# EAGLE design motor_controller_link (EAGLE 8.3.1)
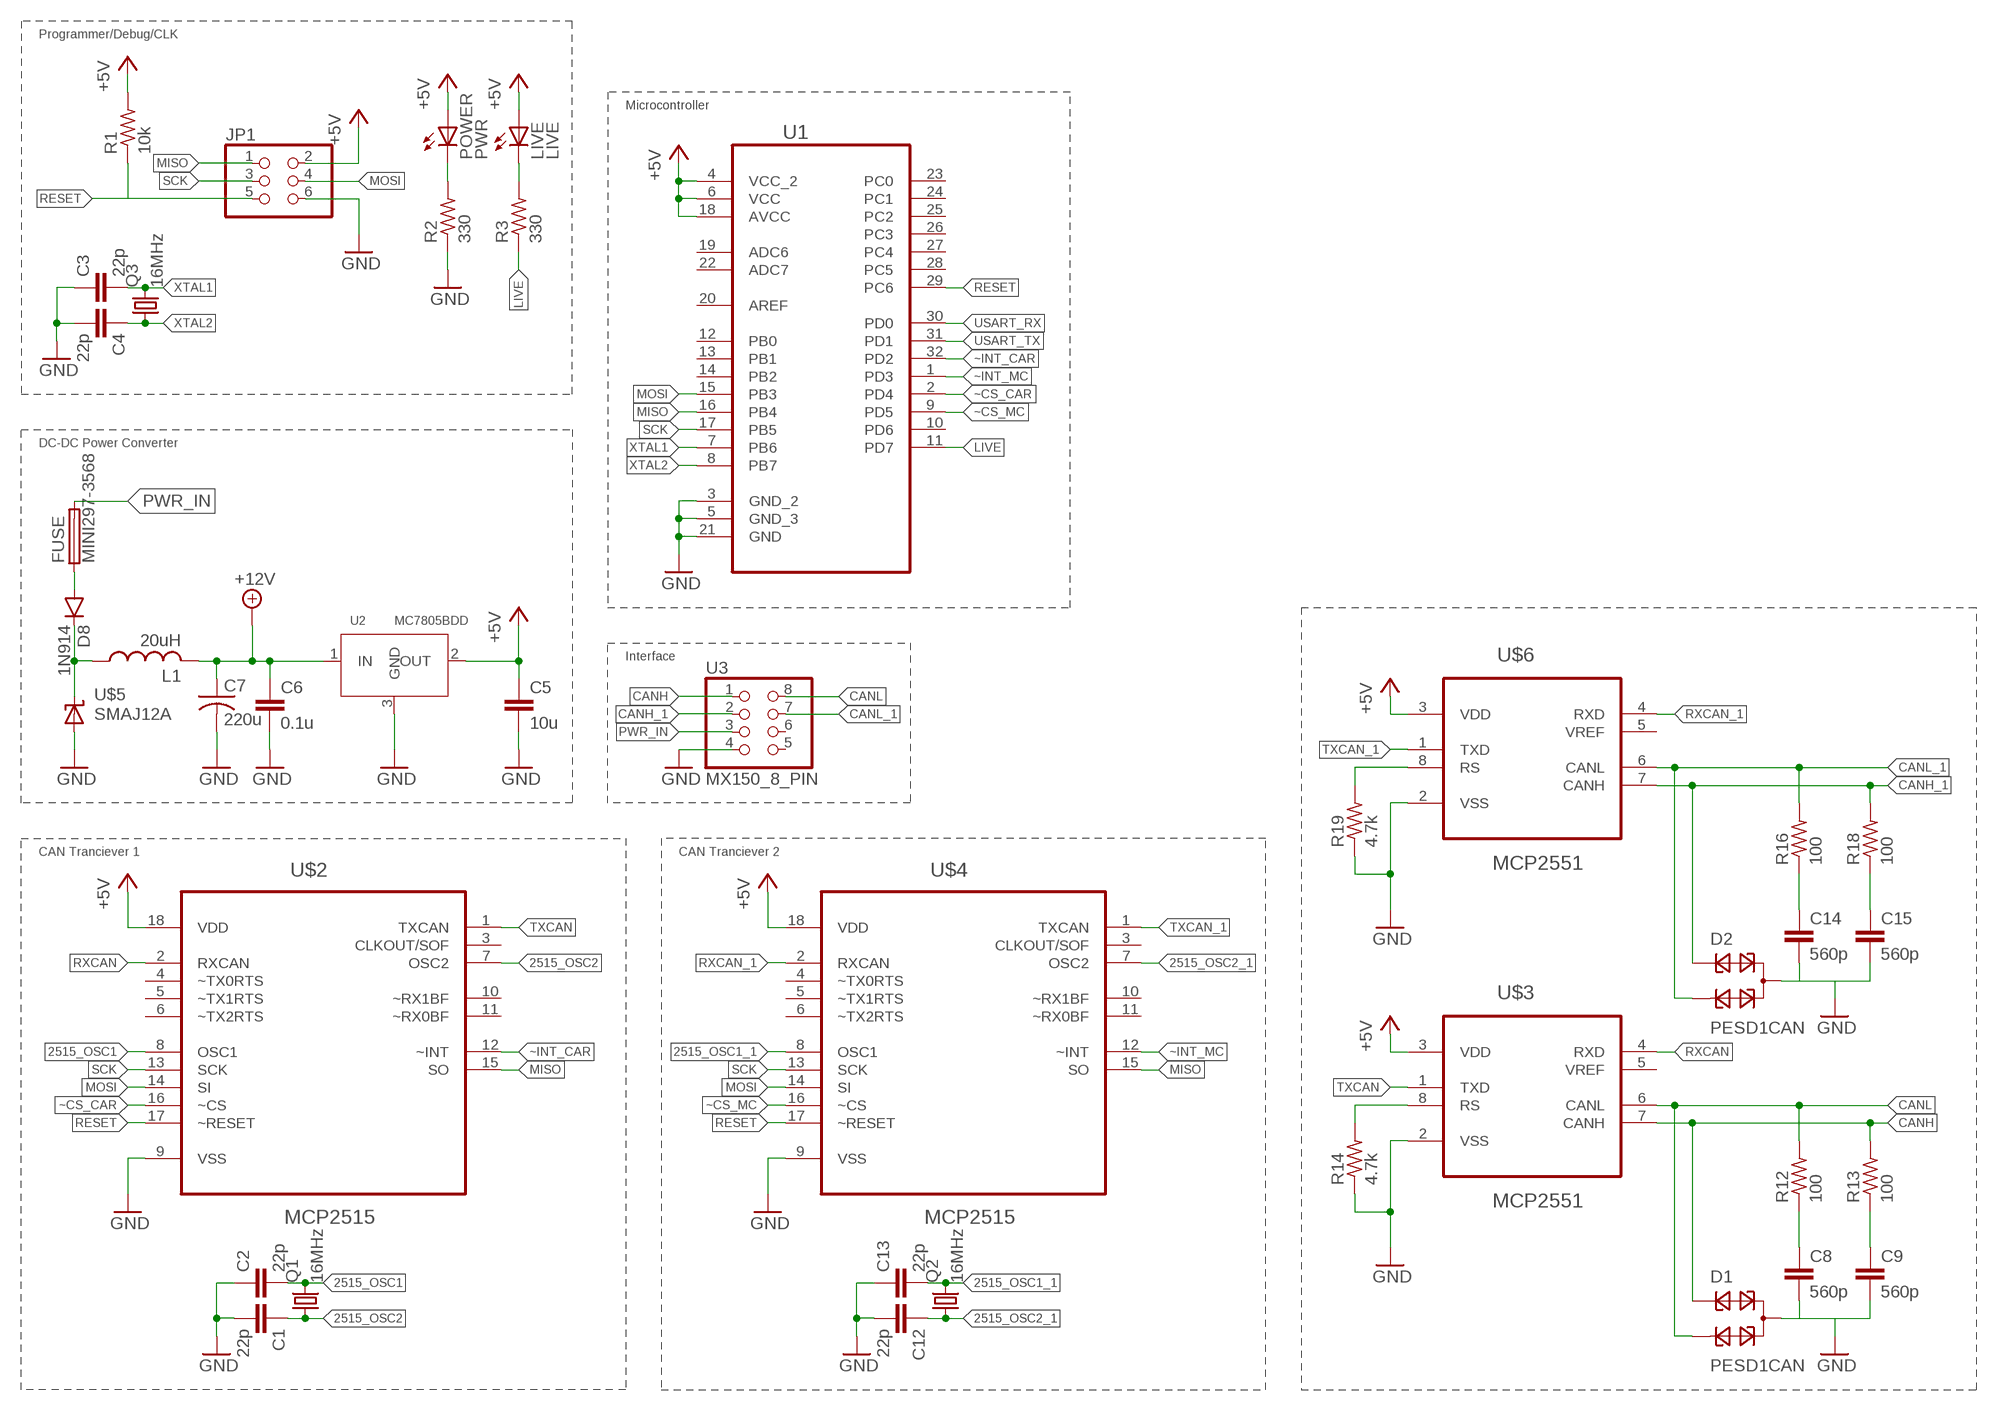
[diagram p0: schematic, sheet 1]

## Parts
C1  22p  C-EUC0805K  [C0805K]
C2  22p  C-EUC0805K  [C0805K]
C3  22p  C-EUC0805K  [C0805K]
C4  22p  C-EUC0805K  [C0805K]
C5  10u  C-EUC0805K  [C0805K]
C6  0.1u  C-EUC0805K  [C0805K]
C7  220u  C1206  [C1206]
C8  560p  C-EUC0805K  [C0805K]
C9  560p  C-EUC0805K  [C0805K]
C12  22p  C-EUC0805K  [C0805K]
C13  22p  C-EUC0805K  [C0805K]
C14  560p  C-EUC0805K  [C0805K]
C15  560p  C-EUC0805K  [C0805K]
D1  PESD1CAN  [SOT23]
D2  PESD1CAN  [SOT23]
D8  1N914  DIODESMA  [SMA-DIODE]
FUSE  MINI297-3568  [3568]
JP1  PINHD-2X3  [2X03]
L1  20uH  MSS7348  [MSS7348]
LIVE  LIVE  LEDSML0805  [SML0805]
POWER  PWR  LEDSML0805  [SML0805]
Q1  16MHz  CRYSTALCTS406  [CTS406]
Q2  16MHz  CRYSTALCTS406  [CTS406]
Q3  16MHz  CRYSTALCTS406  [CTS406]
R1  10k  R-US_R0805  [R0805]
R2  330  R-US_R0805  [R0805]
R3  330  R-US_R0805  [R0805]
R12  100  R-US_R0805  [R0805]
R13  100  R-US_R0805  [R0805]
R14  4.7k  R-US_R0805  [R0805]
R16  100  R-US_R0805  [R0805]
R18  100  R-US_R0805  [R0805]
R19  4.7k  R-US_R0805  [R0805]
U1  ATMEGA328P-AU  [QFP80P900X900X120-32N]
U2  MC7805BDD  [DPAK]
U3  MX150_8_PIN  [MX150_8]
U$2  MCP2515  MCP2515-I/SO  [SOIC127P1034X264-18N]
U$3  MCP2551  MCP2551-I/SN  [SOIC127P600X175-8N]
U$4  MCP2515  MCP2515-I/SO  [SOIC127P1034X264-18N]
U$5  SMAJ12A  [DO-214AC]
U$6  MCP2551  MCP2551-I/SN  [SOIC127P600X175-8N]

## Nets
2515_OSC1: C2.2 Q1.3 U$2.8(OSC1)
2515_OSC1_1: C13.2 Q2.3 U$4.8(OSC1)
2515_OSC2: C1.1 Q1.1 U$2.7(OSC2)
2515_OSC2_1: C12.1 Q2.1 U$4.7(OSC2)
+5V: C5.1 JP1.2 LIVE.A POWER.A R1.2 U1.4(VCC_2) U1.6(VCC) U1.18(AVCC) U2.2(OUT) U$2.18(VDD) U$3.3(VDD) U$4.18(VDD) U$6.3(VDD)
+12V: C6.1 C7.1 L1.P$2 U2.1(IN)
CANH: D1.1 R13.2 U3.1 U$3.7(CANH)
CANH_1: D2.1 R18.2 U3.2 U$6.7(CANH)
CANL: D1.2 R12.2 U3.8 U$3.6(CANL)
CANL_1: D2.2 R16.2 U3.7 U$6.6(CANL)
GND: C1.2 C2.1 C3.1 C4.2 C5.2 C6.2 C7.2 C8.2 C9.2 C12.2 C13.1 C14.2 C15.2 D1.3 D2.3 JP1.6 R2.1 R14.1 R19.1 U1.3(GND_2) U1.5(GND_3) U1.21(GND) U2.3(GND) U3.4 U$2.9(VSS) U$3.2(VSS) U$4.9(VSS) U$5.A U$6.2(VSS)
LIVE: R3.1 U1.11(PD7)
MISO: JP1.1 U1.16(PB4) U$2.15(SO) U$4.15(SO)
MOSI: JP1.4 U1.15(PB3) U$2.14(SI) U$4.14(SI)
N$1: R14.2 U$3.8(RS)
N$2: C14.1 R16.1
N$4: POWER.C R2.2
N$5: LIVE.C R3.2
N$6: C8.1 R12.1
N$7: C9.1 R13.1
N$9: C15.1 R18.1
N$10: D8.C L1.P$1 U$5.C
N$11: R19.2 U$6.8(RS)
N$12: D8.A FUSE.P$1 FUSE.P$4
PWR_IN: FUSE.P$2 FUSE.P$3 U3.3
RESET: JP1.5 R1.1 U1.29(PC6) U$2.17(~RESET) U$4.17(~RESET)
RXCAN: U$2.2(RXCAN) U$3.4(RXD)
RXCAN_1: U$4.2(RXCAN) U$6.4(RXD)
SCK: JP1.3 U1.17(PB5) U$2.13(SCK) U$4.13(SCK)
TXCAN: U$2.1(TXCAN) U$3.1(TXD)
TXCAN_1: U$4.1(TXCAN) U$6.1(TXD)
USART_RX: U1.30(PD0)
USART_TX: U1.31(PD1)
XTAL1: C3.2 Q3.3 U1.7(PB6)
XTAL2: C4.1 Q3.1 U1.8(PB7)
~CS_CAR: U1.2(PD4) U$2.16(~CS)
~CS_MC: U1.9(PD5) U$4.16(~CS)
~INT_CAR: U1.32(PD2) U$2.12(~INT)
~INT_MC: U1.1(PD3) U$4.12(~INT)
Unconnected: U1.10(PD6) U1.12(PB0) U1.13(PB1) U1.14(PB2) U1.19(ADC6) U1.20(AREF) U1.22(ADC7) U1.23(PC0) U1.24(PC1) U1.25(PC2) U1.26(PC3) U1.27(PC4) U1.28(PC5) U3.5 U3.6 U$2.3(CLKOUT/SOF) U$2.4(~TX0RTS) U$2.5(~TX1RTS) U$2.6(~TX2RTS) U$2.10(~RX1BF) U$2.11(~RX0BF) U$3.5(VREF) U$4.3(CLKOUT/SOF) U$4.4(~TX0RTS) U$4.5(~TX1RTS) U$4.6(~TX2RTS) U$4.10(~RX1BF) U$4.11(~RX0BF) U$6.5(VREF)

## Notes on the sheet
- Programmer/Debug/CLK
- Microcontroller
- DC-DC Power Converter
- Interface
- CAN Tranciever 1 | CAN Tranciever 2

## Library data of the parts
C1-C4 C12 C13 = resistor:C-EU: CAPACITOR, European symbol
C5 C6 C8 C9 C14 C15 = rcl:C-EU: CAPACITOR, European symbol
C7 = Capacitors:C1206
D1 D2 = diode:PESD1CAN: CAN bus ESD protection diode Source: http://www.nxp.com/documents/data_sheet/PESD1CAN.pdf
D8 = SparkFun-DiscreteSemi:DIODE: Diode These are standard reverse protection diodes and small signal diodes. SMA package can handle up to about 1A. SOD-323 can handle about 200mA. What the SOD-323 package when ordering, there are some mfgs out there that are 5-pin packages.
FUSE = Fuse:MINI297-3568
JP1 = pinhead:PINHD-2X3: PIN HEADER
L1 = Inductors:MSS7348
LIVE POWER = led:LED: LED OSRAM: - CHIPLED LG R971, LG N971, LY N971, LG Q971, LY Q971, LO R971, LY R971 LH N974, LH R974 LS Q976, LO Q976, LY Q976 LO Q996 - Hyper CHIPLED LW Q18S LB Q993, LB Q99A, LB R99A - SideLED LS A670, LO A670, LY A670, LG A670, LP A670 LB A673, LV A673, LT A673, LW A673 LH A674 LY A675 LS A676, LA A676, LO A676, LY A676, LW A676 LS A679, LY A679, LG A679 - Hyper Micro SIDELED® LS Y876, LA Y876, LO Y876, LY Y876 LT Y87S - SmartLED LW L88C, LW L88S LB L89C, LB L89S, LG L890 LS L89K, LO L89K, LY L89K LS L896, LA L896, LO L896, LY L896 - TOPLED LS T670, LO T670, LY T670, LG T670, LP T670 LSG T670, LSP T670, LSY T670, LOP T670, LYG T670 LG T671, LOG T671, LSG T671 LB T673, LV T673, LT T673, LW T673 LH T674 LS T676, LA T676, LO T676, LY T676, LB T676, LH T676, LSB T676, LW T676 LB T67C, LV T67C, LT T67C, LS T67K, LO T67K, LY T67K, LW E67C LS E67B, LA E67B, LO E67B, LY E67B, LB E67C, LV E67C, LT E67C LW T67C LS T679, LY T679, LG T679 LS T770, LO T770, LY T770, LG T770, LP T770 LB T773, LV T773, LT T773, LW T773 LH T774 LS E675, LA E675, LY E675, LS T675 LS T776, LA T776, LO T776, LY T776, LB T776 LHGB T686 LT T68C, LB T68C - Hyper Mini TOPLED® LB M676 - Mini TOPLED Santana® LG M470 LS M47K, LO M47K, LY M47K Source: http://www.osram.convergy.de LUXEON: - LUMILED® LXK2-PW12-R00, LXK2-PW12-S00, LXK2-PW14-U00, LXK2-PW14-V00 LXK2-PM12-R00, LXK2-PM12-S00, LXK2-PM14-U00 LXK2-PE12-Q00, LXK2-PE12-R00, LXK2-PE12-S00, LXK2-PE14-T00, LXK2-PE14-U00 LXK2-PB12-K00, LXK2-PB12-L00, LXK2-PB12-M00, LXK2-PB14-N00, LXK2-PB14-P00, LXK2-PB14-Q00 LXK2-PR12-L00, LXK2-PR12-M00, LXK2-PR14-Q00, LXK2-PR14-R00 LXK2-PD12-Q00, LXK2-PD12-R00, LXK2-PD12-S00 LXK2-PH12-R00, LXK2-PH12-S00 LXK2-PL12-P00, LXK2-PL12-Q00, LXK2-PL12-R00 Source: www.luxeon.com KINGBRIGHT: KA-3528ASYC Source: www.kingbright.com
Q1-Q3 = adafruit:CRYSTAL: CRYSTAL; OC_FARNELL: unknown; OC_NEWARK: unknown
R1-R3 R12-R14 R16 R18 R19 = rcl:R-US_: RESISTOR, American symbol
U1 = Atmel_By_element14_Batch_1-00:ATMEGA328P-AU: 8-bit Microcontroller with In-System Programmable Flash; MPN: ATMEGA328P-AU; OC_FARNELL: 1715486; OC_NEWARK: 14R4631; PACKAGE: TQFP-32; SUPPLIER: Atmel
U2 = IC's:MC7805BD
U3 = Connectors:MX150_8_PIN
U$2 U$4 = Microchip_By_element14_Batch_1:MCP2515-I/SO: CAN Controller; MPN: MCP2515-I/SO; OC_FARNELL: 1292239; OC_NEWARK: 29H7136; PACKAGE: SOIC-18; SUPPLIER: Microchip
U$3 U$6 = Microchip_By_element14_Batch_1:MCP2551-I/SN: High-Speed CAN Transceiver; MPN: MCP2551-I/SN; OC_FARNELL: 9758569; OC_NEWARK: 69K7604; PACKAGE: SOIC-8; SUPPLIER: Microchip
U$5 = Can_Network_Endpnt.lbr:SMAJ12A

## Board
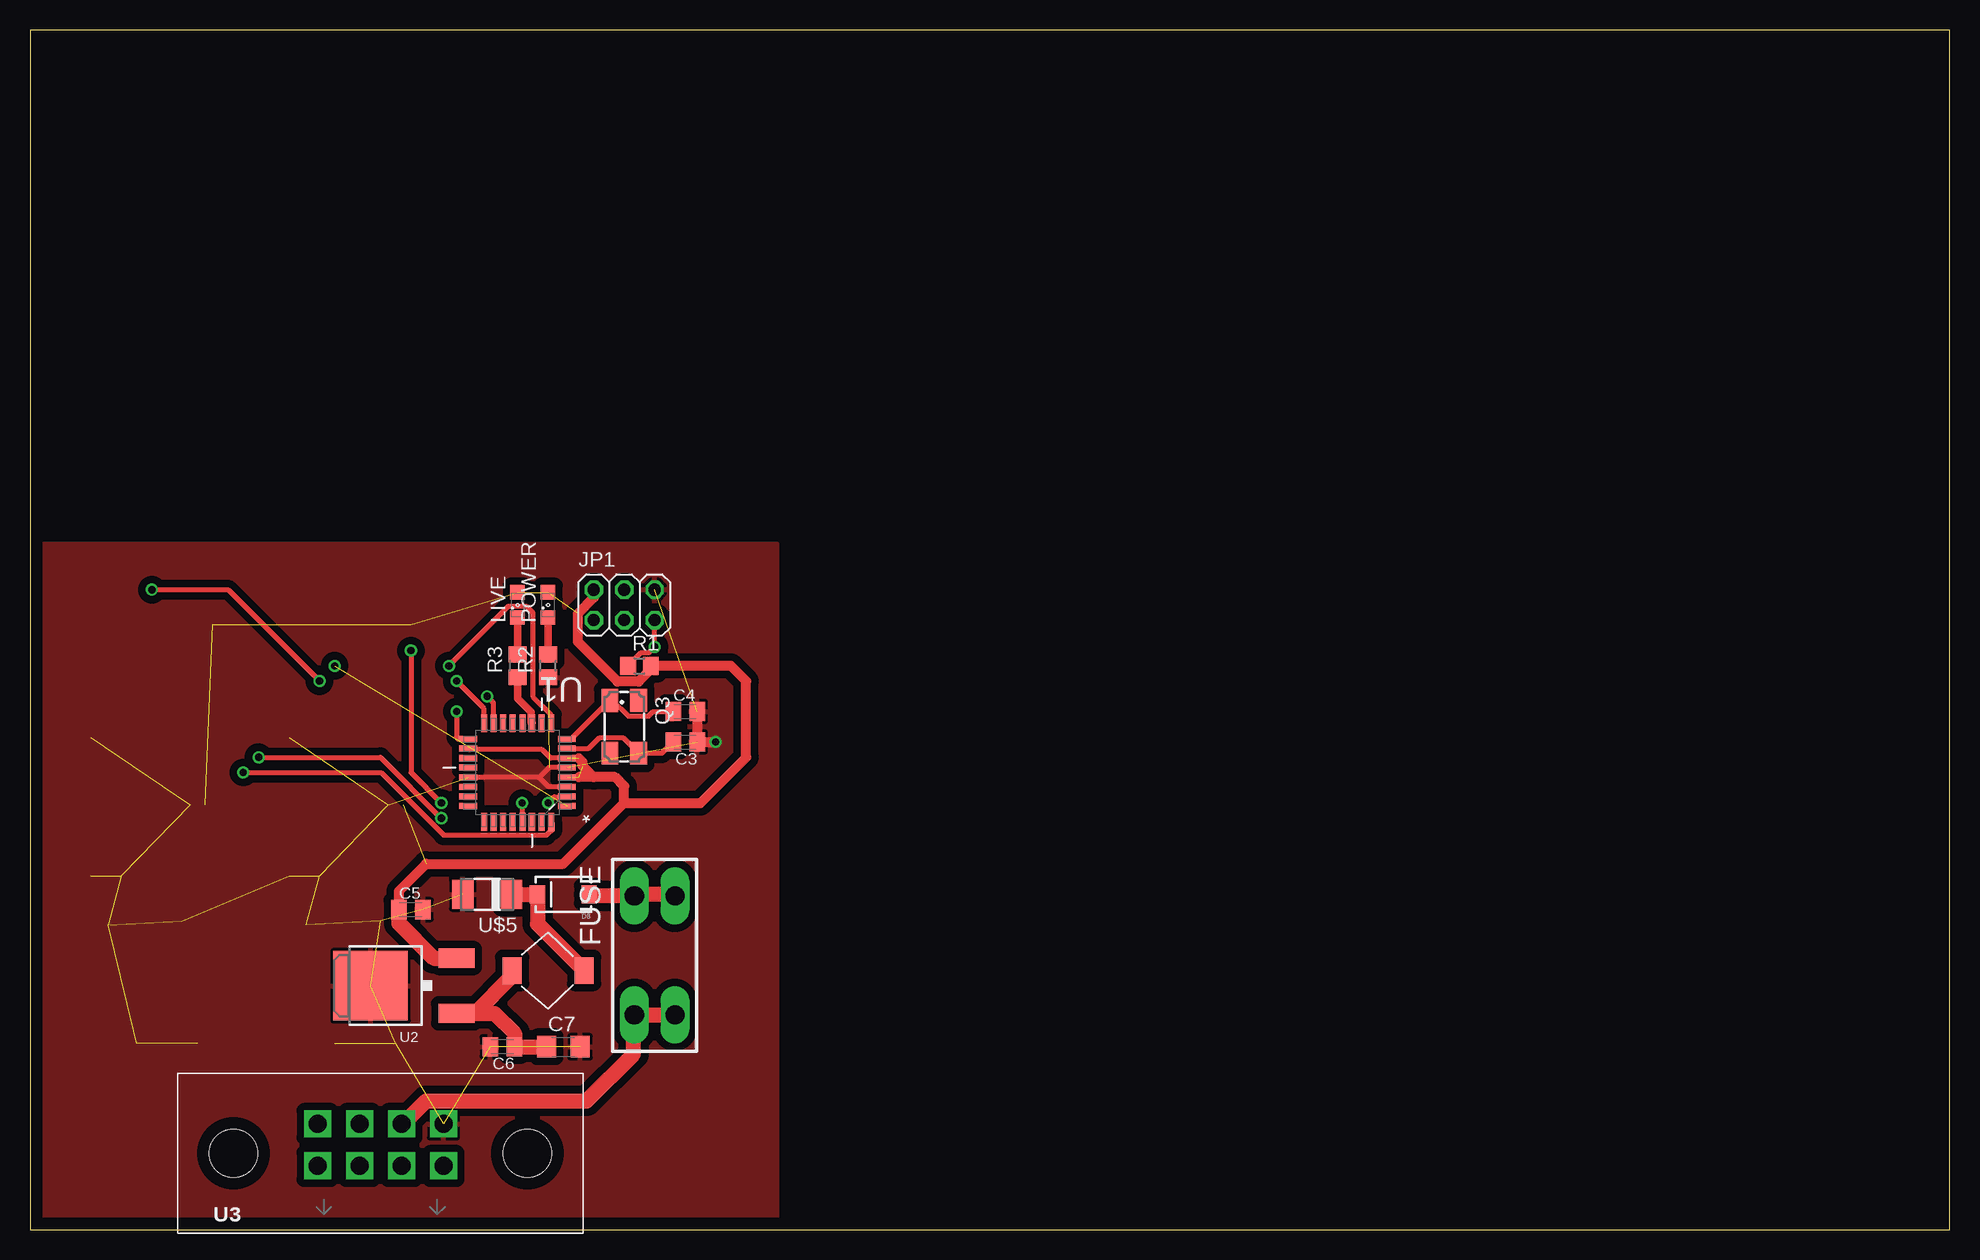
[diagram p1: board, top side]
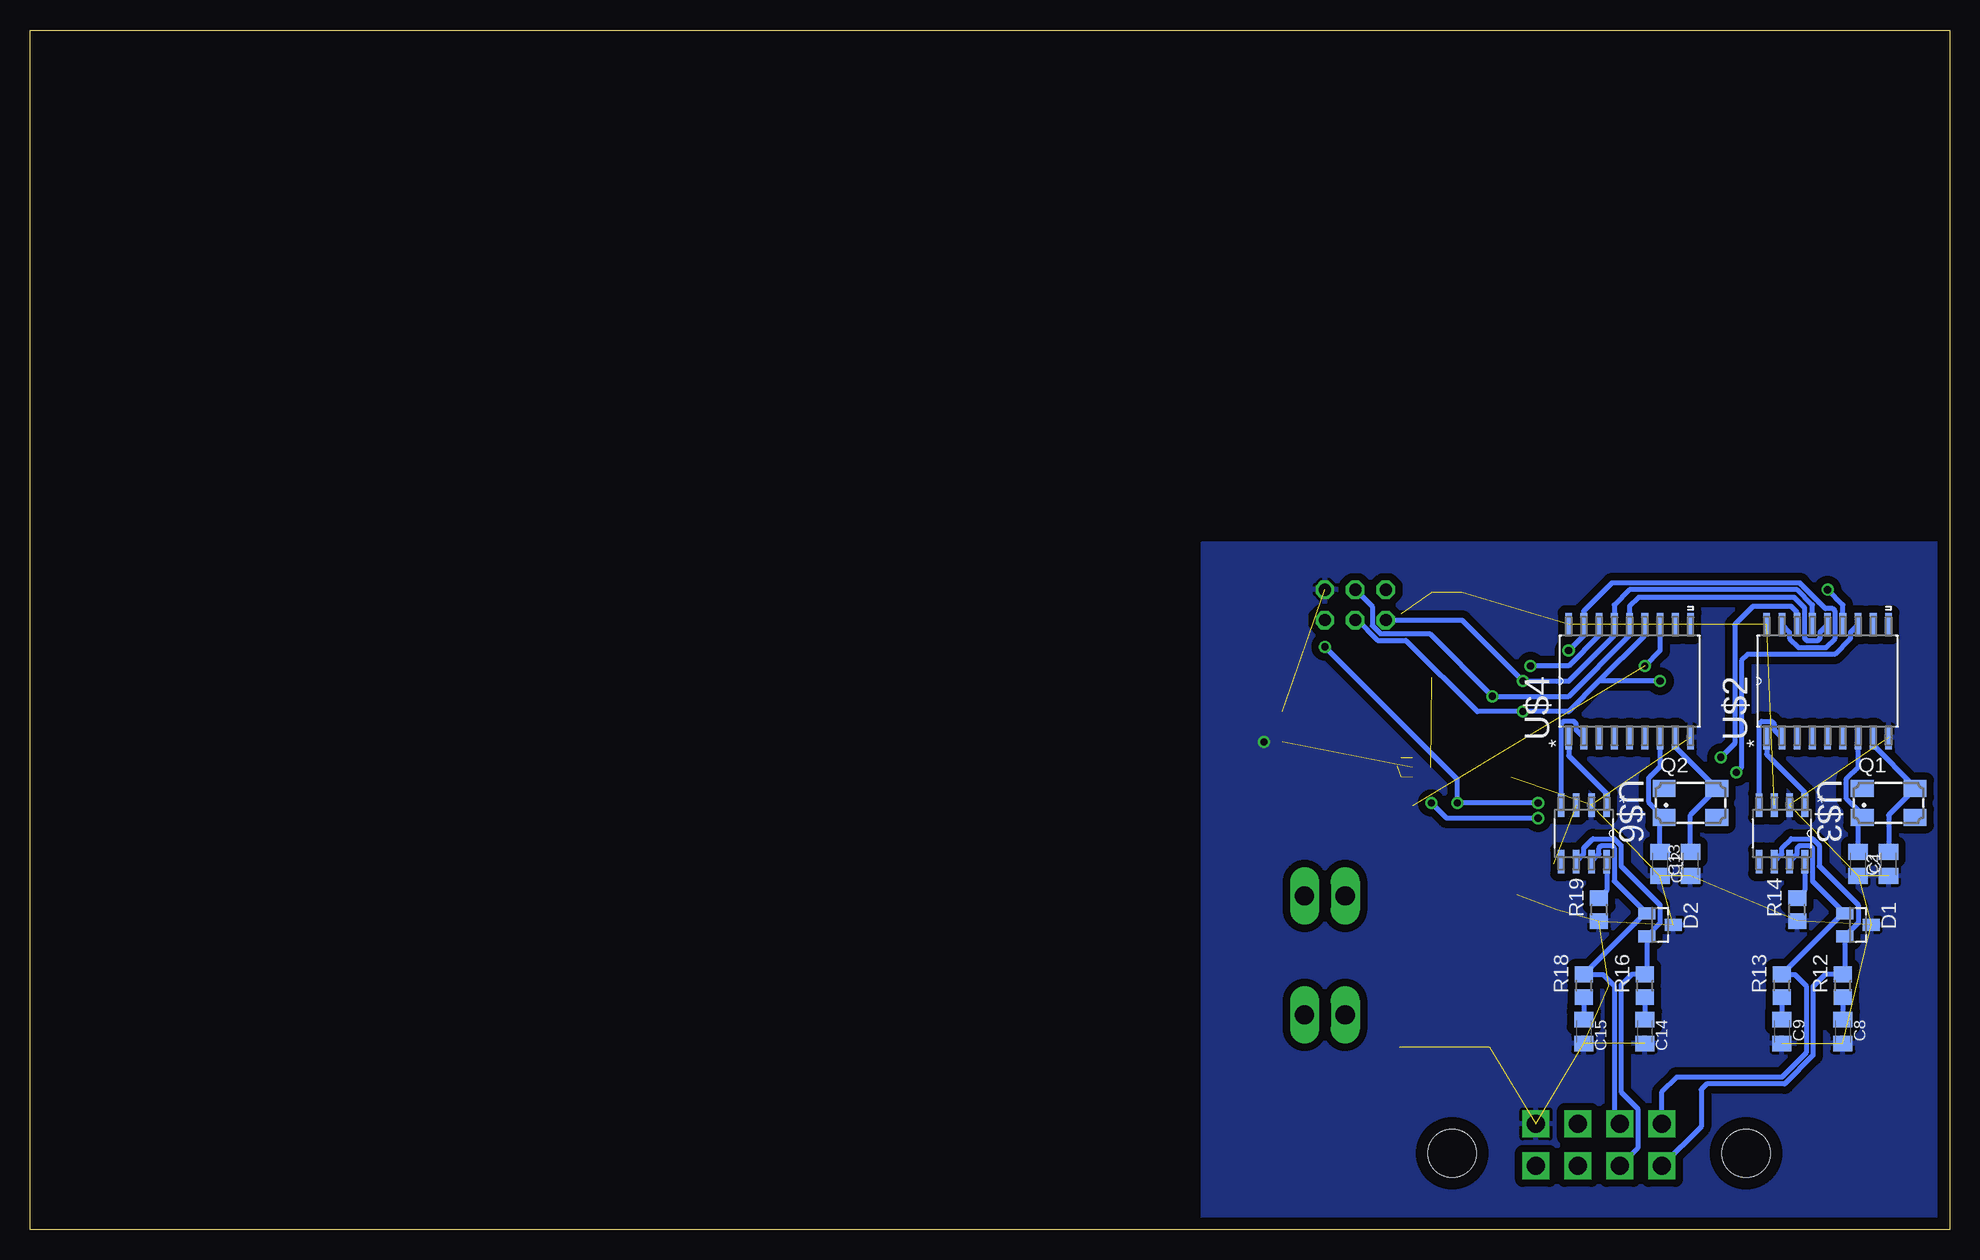
[diagram p2: board, bottom side, seen from below]

Size 160 x 100 mm. Coordinates in mm from the lower left corner, seen from the top.
Outline: 0,0 160,0 160,100 0,100 0,0
Copper layers (1*16): Top 0.035mm / dielectric 1.5mm / Bottom 0.035mm
Design rules "default": minimum track width 6mil, minimum drill 0.35mm, track to track 6mil, track to pad 6mil, pad to pad 6mil, via to via 6mil, smd to smd 6mil, copper to edge 40mil, drill to drill 6mil, minimum pad ring 10mil, minimum via ring 8mil, stop-mask expansion 4mil, vias tented up to drill 0mil, thermal gap 10mil

### Footprints (pad centres in the part's own frame; a part is rotated, then mirrored left to right if it is on the bottom)
C0805K = smd 1.3 x 1.6: 1 -1,0; 2 1,0
C1206 = smd 1.6 x 1.8: 1 -1.4,0; 2 1.4,0
SOT23 = smd 1 x 1.4: 1 -0.95,-1.1; 2 0.95,-1.1; 3 0,1.1
SMA-DIODE = smd 1.27 x 1.47: A -2.15,0; C 2.15,0
3568 = drill 1.6 long: P$1 -4.96,1.7; P$2 4.96,1.7; P$3 4.96,-1.7; P$4 -4.96,-1.7
2X03 = drill 1.016 octagon: 1 -2.54,-1.27; 2 -2.54,1.27; 3 0,-1.27; 4 0,1.27; 5 2.54,-1.27; 6 2.54,1.27
MSS7348 = smd 1.6 x 2.2: P$1 -3,0; P$2 3,0
SML0805 = smd 1.2 x 1.2: A 1.05,0; C -1.05,0
CTS406 = smd 1.9 x 1.4: 1 -2.2,-1.2; 2 2.2,-1.2; 3 2.2,1.2; 4 -2.2,1.2
R0805 = smd 1.3 x 1.5: 1 -0.95,0; 2 0.95,0
QFP80P900X900X120-32N = smd 1.473 x 0.508: 1 -4.115,2.794; 2 -4.115,2.007; 3 -4.115,1.194; 4 -4.115,0.406; 5 -4.115,-0.406; 6 -4.115,-1.194; 7 -4.115,-2.007; 8 -4.115,-2.794; 17 4.115,-2.794; 18 4.115,-2.007; 19 4.115,-1.194; 20 4.115,-0.406; 21 4.115,0.406; 22 4.115,1.194; 23 4.115,2.007; 24 4.115,2.794 | smd 0.508 x 1.473: 9 -2.794,-4.115; 10 -2.007,-4.115; 11 -1.194,-4.115; 12 -0.406,-4.115; 13 0.406,-4.115; 14 1.194,-4.115; 15 2.007,-4.115; 16 2.794,-4.115; 25 2.794,4.115; 26 2.007,4.115; 27 1.194,4.115; 28 0.406,4.115; 29 -0.406,4.115; 30 -1.194,4.115; 31 -2.007,4.115; 32 -2.794,4.115
DPAK = smd 3 x 1.6: 1 0,-2.3; 2 0,2.3 | smd 6.2 x 5.8: 3 -7.18,0
MX150_8 = drill 1.5 square: 1 -5.25,2.46; 2 -1.75,2.46; 3 1.75,2.46; 4 5.25,2.46; 5 5.25,-1.04; 6 1.75,-1.04; 7 -1.75,-1.04; 8 -5.25,-1.04 | hole 4: -12.25,0; 12.25,0
SOIC127P1034X264-18N = smd 1.981 x 0.559: 1 -4.699,5.08; 2 -4.699,3.81; 3 -4.699,2.54; 4 -4.699,1.27; 5 -4.699,0; 6 -4.699,-1.27; 7 -4.699,-2.54; 8 -4.699,-3.81; 9 -4.699,-5.08; 10 4.699,-5.08; 11 4.699,-3.81; 12 4.699,-2.54; 13 4.699,-1.27; 14 4.699,0; 15 4.699,1.27; 16 4.699,2.54; 17 4.699,3.81; 18 4.699,5.08
SOIC127P600X175-8N = smd 1.981 x 0.559: 1 -2.362,1.905; 2 -2.362,0.635; 3 -2.362,-0.635; 4 -2.362,-1.905; 5 2.362,-1.905; 6 2.362,-0.635; 7 2.362,0.635; 8 2.362,1.905
DO-214AC = smd 1.8 x 2.4: A 2.025,0; C -2.025,0

### Placement (x,y rotation side)
C1  7.62,30.48 270 bottom
C2  5.08,30.48 90 bottom
C3  54.61,40.64 180 top
C4  54.61,43.18 0 top
C5  31.75,26.67 0 top
C6  39.37,15.24 180 top
C7  44.45,15.24 0 top
C8  8.89,16.51 270 bottom
C9  13.97,16.51 270 bottom
C12  24.13,30.48 270 bottom
C13  21.59,30.48 90 bottom
C14  25.4,16.51 270 bottom
C15  30.48,16.51 270 bottom
D1  7.62,25.4 270 bottom
D2  24.13,25.4 270 bottom
D8  44.45,27.94 180 top
FUSE  52.07,22.86 270 top
JP1  49.53,52.07 0 top
L1  43.18,21.59 180 top
LIVE  40.64,52.07 90 top
POWER  43.18,52.07 90 top
Q1  5.08,35.56 0 bottom
Q2  21.59,35.56 0 bottom
Q3  49.53,41.91 270 top
R1  50.8,46.99 0 top
R2  43.18,46.99 90 top
R3  40.64,46.99 90 top
R12  8.89,20.32 90 bottom
R13  13.97,20.32 90 bottom
R14  12.7,26.67 90 bottom
R16  25.4,20.32 90 bottom
R18  30.48,20.32 90 bottom
R19  29.21,26.67 90 bottom
U1  40.64,38.1 180 top
U2  35.56,20.32 0 top
U3  29.21,6.35 0 top
U$2  10.16,45.72 90 bottom
U$3  13.97,33.02 270 bottom
U$4  26.67,45.72 90 bottom
U$5  38.1,27.94 180 top
U$6  30.48,33.02 270 bottom

### Tracks (layer width: path | path; a pad name or v marks a point on that pad's centre or on a via)
2515_OSC1
  Bottom 0.406: C2.2 5.08,34.54 2.88,36.74 Q1.3 2.88,36.92 6.35,40.39 U$2.8
2515_OSC1_1
  Bottom 0.406: C13.2 21.59,34.56 Q2.3 22.86,40.23 U$4.8
2515_OSC2
  Bottom 0.406: C1.1 7.62,34.02 Q1.1 7.28,34.61 8.59,35.91 8.59,37.61 7.62,38.57 U$2.7
2515_OSC2_1
  Bottom 0.406: C12.1 24.13,34.02 Q2.1 25.1,35.67 25.1,37.61 24.13,38.57 U$4.7
+5V  (9 unrouted)
  Top 0.406: U1.6 43.38,39.29 42.67,40.01 36.63,40.01 U1.18
  Top 0.813: C5.1 30.75,28.21 33.02,30.48 44.45,30.48 49.53,35.56 | 45.75,37.72 48.77,37.72 49.53,36.96 49.53,35.56 | 45.74,39.31 46.05,38.99 46.05,38.66 46.99,37.72 | 49.53,35.56 55.88,35.56 59.69,39.37 59.69,45.72 58.42,46.99 54.61,46.99 | 54.61,46.99 R1.2 | 54.61,46.99 52.04,46.99 50.73,45.68 48.97,45.68 45.67,48.98 45.67,51.35 46.99,52.67 JP1.2
  Top 1.27: C5.1 30.75,25.51 33.66,22.61 35.55,22.61 U2.2
+12V
  Top 1.27: L1.P$2 40.18,21.13 37.08,18.03 35.57,18.03 U2.1 38.75,18.02 40.39,16.38 40.39,15.26 C6.1 C7.1
CANH
  Bottom 0.406: U$3.7 12.7,31.29 12.7,31.8 12.49,32 11.64,32 11.43,31.8 11.43,29.06 D1.1 8.89,26.35 R13.2 12.89,21.27 11.94,20.32 11.94,14.73 13.97,12.7 22.73,12.7 24,11.43 24,8.85 U3.1
CANH_1
  Bottom 0.406: U$6.7 29.21,31.29 29.21,31.8 29,32 28.15,32 27.94,31.8 27.94,29.06 D2.1 25.4,26.35 R18.2 28.89,21.27 27.94,20.32 27.94,9.29 U3.2
CANL
  Bottom 0.406: U$3.6 13.97,31.29 13.97,31.8 13.2,32.56 11.41,32.56 10.87,32.03 10.87,30.3 7.62,27.05 7.62,25.55 D1.2 8.72,21.44 R12.2 10.35,21.27 11.38,20.24 11.38,14.5 13.74,12.14 20.24,12.14 20.7,11.68 20.7,8.57 U3.8
CANL_1
  Bottom 0.406: U$6.6 30.48,31.29 30.48,31.8 29.71,32.56 27.92,32.56 27.38,32.03 27.38,30.3 24.13,27.05 24.13,25.55 D2.2 25.23,21.44 R16.2 26.48,21.27 27.38,20.37 27.38,11.48 25.98,10.08 25.98,6.79 U3.7
GND  (via drill 0.6)  (25 unrouted)
  Top 0.406: 42.44,37.69 U1.21 | 42.44,37.69 43.18,36.96 44.7,36.96 U1.3 | U1.5 43.26,38.51 42.44,37.69
  Top 0.813: C4.2 C3.1 v57.15,40.64
  pour Bottom (isolate 0.635): 0,57.15 62.23,57.15 62.23,0 0,0
  pour Top (isolate 0.635): 0,57.15 62.23,57.15 62.23,0 0,0
LIVE
  Top 0.61: U1.11 41.76,42.29 41.76,43.14 40.64,44.26 R3.1
MISO  (via drill 0.6)
  Top 0.406: U1.16 37.85,43.43 v35.56,45.72
  Bottom 0.406: JP1.1 40.64,50.8 v35.56,45.72 31.75,45.72 27.94,49.53 U$4.15 27.94,52.07 26.67,53.34 12.7,53.34 11.43,52.07 U$2.15
MOSI  (via drill 0.6)
  Top 0.406: U1.15 38.63,43.92 v38.1,44.45
  Bottom 0.406: JP1.4 48.11,51.92 48.11,50.34 47.45,49.68 43.33,49.68 v38.1,44.45 31.75,44.45 26.67,49.53 U$4.14 26.67,51.94 25.91,52.7 12.95,52.7 12.06,51.82 12.06,49.28 11.86,49.07 11,49.07 10.79,49.28 10.79,49.78 U$2.14
N$1
  Bottom 0.406: U$3.8 12.06,28.25 R14.2
N$2
  Bottom 0.406: R16.1 C14.1
N$4
  Top 0.61: POWER.C R2.2
N$5
  Top 0.61: LIVE.C R3.2
N$6
  Bottom 0.406: R12.1 C8.1
N$7
  Bottom 0.406: R13.1 C9.1
N$9
  Bottom 0.406: R18.1 C15.1
N$10
  Top 1.27: U$5.C D8.C 42.3,25.47 L1.P$1
N$11
  Bottom 0.406: U$6.8 28.57,28.25 R19.2
N$12
  Top 1.27: FUSE.P$1 53.46,27.82 53.34,27.94 50.49,27.94 FUSE.P$4 46.72,27.82 D8.A
PWR_IN
  Top 1.27: U3.3 31.1,8.81 33.01,10.72 46.41,10.72 50.29,14.61 50.29,17.82 FUSE.P$3 FUSE.P$2
RESET  (via drill 0.6)
  Top 0.406: JP1.5 v52.07,48.58 51.59,48.1 50.95,48.1 50.74,47.89 50.74,47.88 R1.1 | U1.29 41.02,33.98 v41.02,35.56 | v31.75,48.26 31.75,38.1 v34.29,35.56
  Bottom 0.406: U$2.17 13.34,49.78 13.34,49.28 12.57,48.51 10.29,48.51 9.53,49.28 9.53,51.56 9.73,51.77 10.34,51.77 12.47,53.9 28.14,53.9 30.48,51.56 U$4.17 30.48,49.53 v31.75,48.26 | v52.07,48.58 41.02,37.53 v41.02,35.56 v34.29,35.56
RXCAN
  Bottom 0.406: U$2.2 14.61,41.66 14.61,42.16 14.81,42.37 15.67,42.37 15.88,42.16 U$3.4
RXCAN_1
  Bottom 0.406: U$6.4 32.38,42.16 32.18,42.37 31.32,42.37 31.11,42.16 31.11,41.66 U$4.2
SCK  (via drill 0.6)
  Top 0.406: v35.56,43.18 35.56,41.02 35.69,40.89 U1.17 | v10.16,53.34 16.51,53.34 v24.13,45.72
  Bottom 0.406: JP1.3 49.36,50.8 47.68,49.12 45.31,49.12 39.37,43.18 v35.56,43.18 31.75,43.18 29.21,45.72 | U$4.13 25.4,49.53 29.21,45.72 | U$2.13 8.89,52.07 v10.16,53.34 | v24.13,45.72 29.21,45.72
TXCAN
  Bottom 0.406: U$2.1 15.24,39.62 12.06,36.45 U$3.1
TXCAN_1
  Bottom 0.406: U$4.1 31.75,39.5 28.57,36.32 U$6.1
XTAL1
  Top 0.406: U1.7 46.57,40.11 47.48,41.02 49.42,41.02 Q3.3 52.68,39.71 C3.2
XTAL2
  Top 0.406: U1.8 45.11,40.89 Q3.1 48.58,44.11 49.88,42.8 51.58,42.8 51.95,43.18 C4.1
~CS_CAR  (via drill 0.6)
  Top 0.406: v19.05,39.37 29.21,39.37 v34.29,34.29 | U1.2 44.73,36.07 43.69,36.07 v43.18,35.56
  Bottom 0.406: U$2.16 12.7,51.44 13.21,51.94 16.38,51.94 17.91,50.42 17.91,40.51 v19.05,39.37 | v34.29,34.29 41.91,34.29 v43.18,35.56
~CS_MC  (via drill 0.6)
  Top 0.406: v34.92,46.99 34.91,46.99 39.89,51.98 41.39,51.98 41.6,51.77 41.6,51.75 41.91,51.44 41.91,44.45 43.43,42.93 U1.9
  Bottom 0.406: U$4.16 29.21,49.53 31.75,46.99 v34.92,46.99
~INT_CAR  (via drill 0.6)
  Top 0.406: v17.78,38.1 29.27,38.1 34.47,32.89 43.05,32.89 43.43,33.27 43.56,33.27 43.56,33.86 U1.32
  Bottom 0.406: U$2.12 8.26,49.78 8.26,49.28 9.58,47.95 16.82,47.95 17.35,47.42 17.35,38.53 v17.78,38.1
~INT_MC  (via drill 0.6)  (1 unrouted)
  Bottom 0.406: U$4.12 24.13,48.26 v25.4,46.99